# Altium schematic sheet Cyusb3014 - 4.SchDoc
size A3
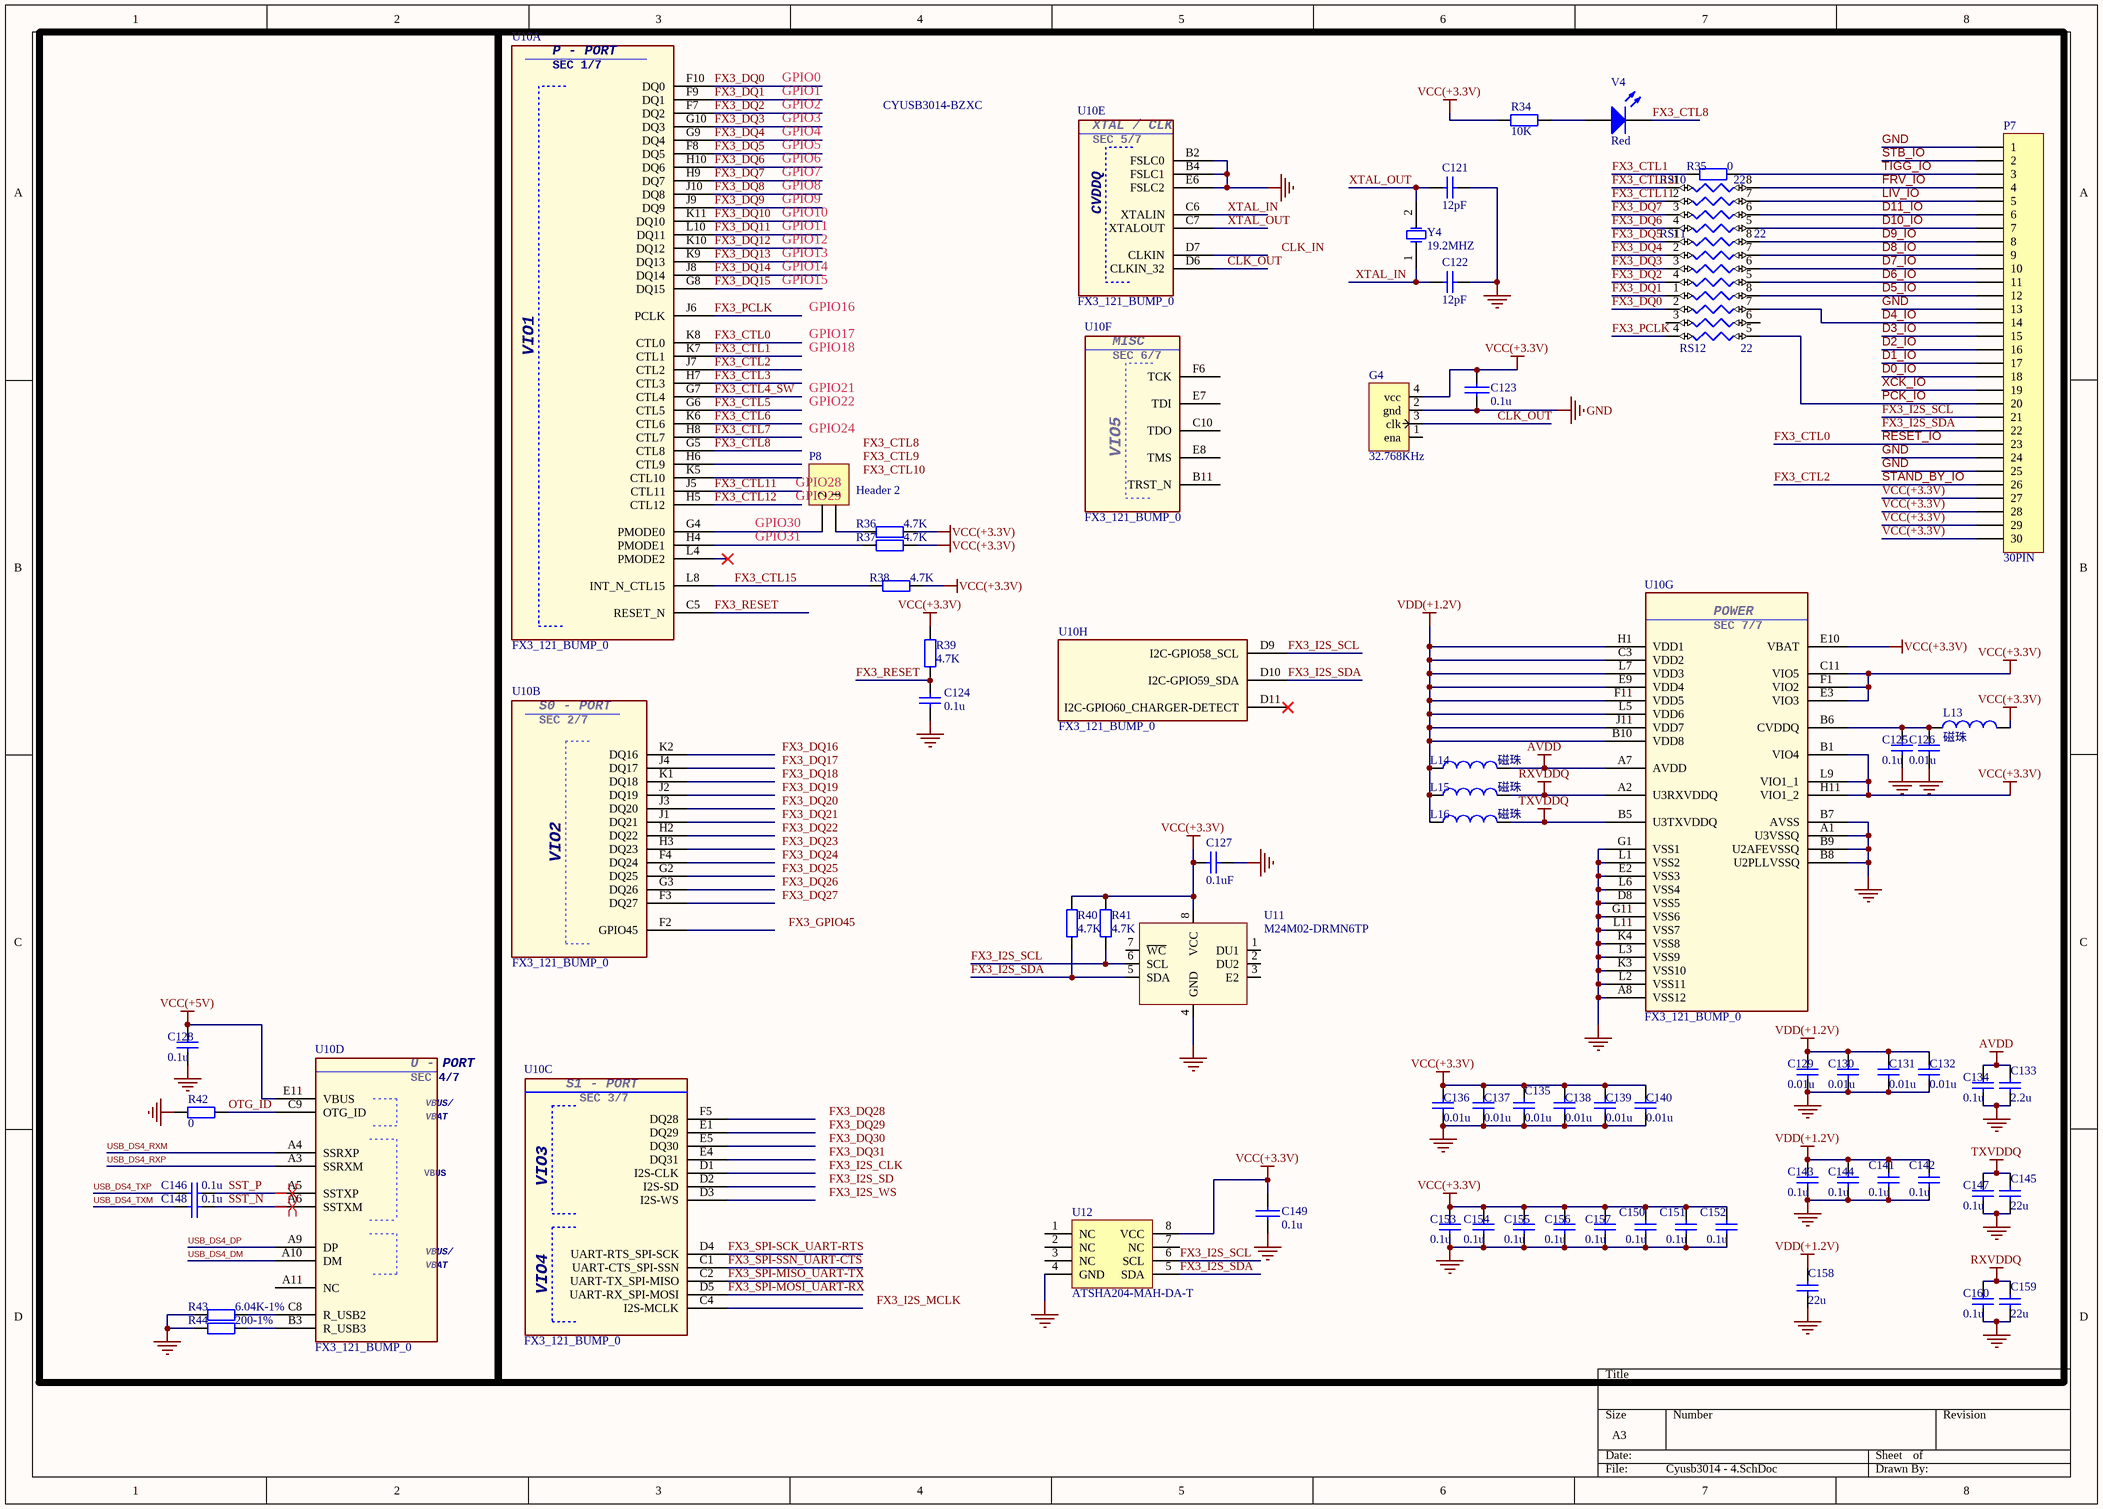
[diagram p0: Cyusb3014 - 4.SchDoc]

## Parts
C121  12pF  [0603S-CAP]
C122  12pF  [0603S-CAP]
C123  0.1u  [0603S-CAP]
C124  0.1u  [0603S-CAP]
C125  0.1u  [C0402]
C126  0.01u  [C0402]
C127  0.1uF  [0603S-CAP]
C128  0.1u  [C0402]
C129  0.01u  [C0402]
C130  0.01u  [C0402]
C131  0.01u  [C0402]
C132  0.01u  [C0402]
C133  2.2u  [C0805S-CAP]
C134  0.1u  [C0402]
C135  0.01u  [C0402]
C136  0.01u  [C0402]
C137  0.01u  [C0402]
C138  0.01u  [C0402]
C139  0.01u  [C0402]
C140  0.01u  [C0402]
C141  0.1u  [C0402]
C142  0.1u  [C0402]
C143  0.1u  [C0402]
C144  0.1u  [C0402]
C145  22u  [C0805S-CAP]
C146  0.1u  [C0402]
C147  0.1u  [C0402]
C148  0.1u  [C0402]
C149  0.1u  [0603S-CAP]
C150  0.1u  [C0402]
C151  0.1u  [C0402]
C152  0.1u  [C0402]
C153  0.1u  [C0402]
C154  0.1u  [C0402]
C155  0.1u  [C0402]
C156  0.1u  [C0402]
C157  0.1u  [C0402]
C158  22u  [C0805S-CAP]
C159  22u  [C0805S-CAP]
C160  0.1u  [C0402]
G4  32.768KHz  [爱普生晶振3.2×2.5mm]
L13  磁珠  [L0603]
L14  磁珠  [L0603]
L15  磁珠  [L0603]
L16  磁珠  [L0603]
P7  30PIN  [FH12-30S-0.5SH]
P8  Header 2  [HDR1X2]
R34  10K  [0603S-RES]
R35  0  [0603S-RES]
R36  4.7K  [0603S-RES]
R37  4.7K  [0603S-RES]
R38  4.7K  [0603S-RES]
R39  4.7K  [0603S-RES]
R40  4.7K  [0603S-RES]
R41  4.7K  [0603S-RES]
R42  0  [0603S-RES]
R43  6.04K-1%  [0603S-RES]
R44  200-1%  [0603S-RES]
RS10  22  [NC06-4]
RS11  22  [NC06-4]
RS12  22  [NC06-4]
U10  FX3_121_BUMP_0  [121_BGA_FX3]  (parts A,B,C,D,E,F,G,H of 8)
U11  M24M02-DRMN6TP  [SOIC127P600X175-8N]
U12  ATSHA204-MAH-DA-T  [UDFN]
V4  Red  [LED0805S]
Y4  19.2MHZ  [爱普生晶振3.2×2.5MM - 无源]

## Nets
AVDD: C133.2 C134.1 L14.2 U10.A7(AVDD)
GND: C121.1 C122.1 C123.2 C124.1 C125.2 C126.2 C127.1 C128.2 C129.2 C130.2 C131.2 C132.2 C133.1 C134.2 C135.2 C136.2 C137.2 C138.2 C139.2 C140.2 C141.2 C142.2 C143.2 C144.2 C145.1 C147.2 C149.2 C150.2 C151.2 C152.2 C153.2 C154.2 C155.2 C156.2 C157.2 C158.1 C159.1 C160.2 G4.2(gnd) P7.1 P7.13 P7.24 P7.25 R42.2 R43.2 R44.2 U10.A1(U3VSSQ) U10.A8(VSS12) U10.B2(FSLC0) U10.B4(FSLC1) U10.B7(AVSS) U10.B8(U2PLLVSSQ) U10.B9(U2AFEVSSQ) U10.D8(VSS5) U10.E2(VSS3) U10.E6(FSLC2) U10.G1(VSS1) U10.G11(VSS6) U10.K3(VSS10) U10.K4(VSS8) U10.L1(VSS2) U10.L2(VSS11) U10.L3(VSS9) U10.L6(VSS4) U10.L11(VSS7) U11.4(GND) U12.4(GND)
RXVDDQ: C159.2 C160.1 L15.2 U10.A2(U3RXVDDQ)
TXVDDQ: C145.2 C147.1 L16.2 U10.B5(U3TXVDDQ)
VCC(+3.3V): C123.1 C127.2 C135.1 C136.1 C137.1 C138.1 C139.1 C140.1 C149.1 C150.1 C151.1 C152.1 C153.1 C154.1 C155.1 C156.1 C157.1 G4.4(vcc) L13.2 P7.27 P7.28 P7.29 P7.30 R34.2 R36.2 R37.2 R38.1 R39.1 R40.2 R41.2 U10.B1(VIO4) U10.C11(VIO5) U10.E3(VIO3) U10.E10(VBAT) U10.F1(VIO2) U10.H11(VIO1_2) U10.L9(VIO1_1) U11.8(VCC) U12.8(VCC)
VCC(+5V): C128.1 U10.E11(VBUS)
VDD(+1.2V): C129.1 C130.1 C131.1 C132.1 C141.1 C142.1 C143.1 C144.1 C158.2 L14.1 L15.1 L16.1 U10.B10(VDD8) U10.C3(VDD2) U10.E9(VDD4) U10.F11(VDD5) U10.H1(VDD1) U10.J11(VDD7) U10.L5(VDD6) U10.L7(VDD3)
CLK_OUT: G4.3(clk) U10.D6(CLKIN_32)
D0_IO: P7.18
D1_IO: P7.17
D2_IO: P7.16
D3_IO: P7.15
D4_IO: P7.14 RS12.7
D5_IO: P7.12 RS12.8
D6_IO: P7.11 RS11.5
D7_IO: P7.10 RS11.6
D8_IO: P7.9 RS11.7
D9_IO: P7.8 RS11.8
D10_IO: P7.7 RS10.5
D11_IO: P7.6 RS10.6
FRV_IO: P7.4 RS10.8
FX3_CTL0: P7.23 U10.K8(CTL0)  [also labelled RESET_IO]
FX3_CTL1: R35.2 U10.K7(CTL1)
FX3_CTL2: P7.26 U10.J7(CTL2)  [also labelled STAND_BY_IO]
FX3_CTL3: U10.H7(CTL3)
FX3_CTL4_SW: U10.G7(CTL4)
FX3_CTL5: U10.G6(CTL5)
FX3_CTL6: U10.K6(CTL6)
FX3_CTL7: U10.H8(CTL7)
FX3_CTL8: U10.G5(CTL8) V4.2(K)
FX3_CTL11: RS10.2 U10.J5(CTL11)
FX3_CTL12: RS10.1 U10.H5(CTL12)
FX3_CTL15: R38.2 U10.L8(INT_N_CTL15)
FX3_DQ0: RS12.2 U10.F10(DQ0)
FX3_DQ1: RS12.1 U10.F9(DQ1)
FX3_DQ2: RS11.4 U10.F7(DQ2)
FX3_DQ3: RS11.3 U10.G10(DQ3)
FX3_DQ4: RS11.2 U10.G9(DQ4)
FX3_DQ5: RS11.1 U10.F8(DQ5)
FX3_DQ6: RS10.4 U10.H10(DQ6)
FX3_DQ7: RS10.3 U10.H9(DQ7)
FX3_DQ8: U10.J10(DQ8)
FX3_DQ9: U10.J9(DQ9)
FX3_DQ10: U10.K11(DQ10)
FX3_DQ11: U10.L10(DQ11)
FX3_DQ12: U10.K10(DQ12)
FX3_DQ13: U10.K9(DQ13)
FX3_DQ14: U10.J8(DQ14)
FX3_DQ15: U10.G8(DQ15)
FX3_I2S_SCL: P7.21 R41.1 U10.D9(I2C-GPIO58_SCL) U11.6(SCL) U12.6(SCL)
FX3_I2S_SDA: P7.22 R40.1 U10.D10(I2C-GPIO59_SDA) U11.5(SDA) U12.5(SDA)
FX3_PCLK: RS12.4 U10.J6(PCLK)
FX3_RESET: C124.2 R39.2 U10.C5(RESET_N)
FX3_SPI-MISO_UART-TX: U10.C2(UART-TX_SPI-MISO)
FX3_SPI-MOSI_UART-RX: U10.D5(UART-RX_SPI-MOSI)
FX3_SPI-SCK_UART-RTS: U10.D4(UART-RTS_SPI-SCK)
FX3_SPI-SSN_UART-CTS: U10.C1(UART-CTS_SPI-SSN)
LIV_IO: P7.5 RS10.7
OTG_ID: R42.1 U10.C9(OTG_ID)
PCK_IO: P7.20 RS12.5
SST_N: C148.2 U10.A6(SSTXM)
SST_P: C146.2 U10.A5(SSTXP)
STB_IO: P7.2
TIGG_IO: P7.3 R35.1
USB_DS4_DM: U10.A10(DM)
USB_DS4_DP: U10.A9(DP)
USB_DS4_RXM: U10.A4(SSRXP)
USB_DS4_RXP: U10.A3(SSRXM)
USB_DS4_TXM: C148.1
USB_DS4_TXP: C146.1
XCK_IO: P7.19
XTAL_IN: C122.2 U10.C6(XTALIN) Y4.1(OSC1)
XTAL_OUT: C121.2 U10.C7(XTALOUT) Y4.2(OSC2)
NetC125_1: C125.1 C126.1 L13.1 U10.B6(CVDDQ)
NetP8_1: P8.1 R36.1
NetP8_2: P8.2 U10.G4(PMODE0)
NetR34_1: R34.1 V4.1(A)
NetR37_1: R37.1 U10.H4(PMODE1)
NetR43_1: R43.1 U10.C8(R_USB2)
NetR44_1: R44.1 U10.B3(R_USB3)

Not connected (* = marked no-connect by the designer): G4 1(ena); RS12 3 6; U10 A11(NC) B11(TRST_N) C4(I2S-MCLK) C10(TDO) D1(I2S-CLK) D2(I2S-SD) D3(I2S-WS) D7(CLKIN) D11(I2C-GPIO60_CHARGER-DETECT)* E1(DQ29) E4(DQ31) E5(DQ30) E7(TDI) E8(TMS) F2(GPIO45) F3(DQ27) F4(DQ24) F5(DQ28) F6(TCK) G2(DQ25) G3(DQ26) H2(DQ22) H3(DQ23) H6(CTL9) J1(DQ21) J2(DQ19) J3(DQ20) J4(DQ17) K1(DQ18) K2(DQ16) K5(CTL10) L4(PMODE2)*; U11 1(DU1) 2(DU2) 3(E2) 7(~{WC}); U12 1(NC) 2(NC) 3(NC) 7(NC)

## Layout directives
differential pair: SST_N, SST_P

## Notes on the sheet
- GPIO0
- GPIO1
- GPIO2
- CYUSB3014-BZXC
- GPIO3
- GPIO4
- GPIO5
- GPIO6
- GPIO7
- GPIO8
- GPIO9
- GPIO10
- GPIO11
- GPIO12
- GPIO13
- GPIO14
- GPIO15
- GPIO16
- GPIO17
- GPIO18
- GPIO21
- GPIO22
- GPIO24
- (near P8) GPIO28
- (near P8) GPIO29
- (near P8) GPIO30
- (near P8) GPIO31
- Labels drawn without touching a wire or pin: CLK_IN, FX3_CTL8, FX3_CTL9, FX3_CTL10, FX3_DQ16, FX3_DQ17, FX3_DQ18, FX3_DQ19, FX3_DQ20, FX3_DQ21, FX3_DQ22, FX3_DQ23, FX3_DQ24, FX3_DQ25, FX3_DQ26, FX3_DQ27, FX3_DQ28, FX3_DQ29, FX3_DQ30, FX3_DQ31, FX3_GPIO45, FX3_I2S_CLK, FX3_I2S_MCLK, FX3_I2S_SD, FX3_I2S_WS
- (in symbol FX3_121_BUMP_0, part A) P - PORT; SEC 1/7; VIO1
- (in symbol FX3_121_BUMP_0, part B) S0 - PORT; SEC 2/7
- (in symbol FX3_121_BUMP_0, part C) S1 - PORT; SEC 3/7
- (in symbol FX3_121_BUMP_0, part D) U - PORT; SEC 4/7; VBUS/
- (in symbol FX3_121_BUMP_0, part E) XTAL / CLK; SEC 5/7
- (in symbol FX3_121_BUMP_0, part F) MISC; SEC 6/7
- (in symbol FX3_121_BUMP_0, part G) POWER; SEC 7/7

## Library data of the parts
C121 C122 = CAP CER SMT 4.3pF 0805: 2. Manufacturere Part Number: C0805C439D5GACTU; 1. Manufacturer: Kemet; 8. Alternate Part: any; 7. Package / Case: 0805; 0. Do Not Install: DNI; 6. Mounting Type: SMT; 5. Supplier Link: http://www.digikey.com/product-detail/en/C0805C439D5GACTU/C0805C439D5GACTU-ND/2212763; 3. Supplier: Digi-Key; 4. Supplier Part Number: C0805C439D5GACTU-ND
C123 C149 = CAP: RC=1206
C124 = Cap: 50V/8.2u/0805; Value: 100n; Published: 8-Jun-2000; LatestRevisionDate: 17-Jul-2002; LatestRevisionNote: Re-released for DXP Platform.; PackageReference: RAD-0.3; Publisher: Altium Limited
C125 C126 C128-C148 C150-C160 = CAP0805: Capacitor; Value: 104; Published: 8-Jun-2000; Revision: July-2002: Re-released for DXP Platform.; Publisher: Altium Limited
C127 = CAP SMT 0.1uF 16V X7R: 2. Manufacturere Part Number: C0805C104K4RACTU; 1. Manufacturer: Kemet; 8. Alternate Part: any; 7. Package / Case: 0805; 6. Mounting Type: SMT; 5. Supplier Link: http://www.digikey.com/product-detail/en/C0805C104K4RACTU/399-1167-1-ND/411442; 3. Supplier: Digi-Key; 4. Supplier Part Number: 399-1167-1-ND
G4 = CTY4-B
L13-L16 = Inductor: Code_IEC: 1005; Value: 10mH; Published: 8-Jun-2000; LatestRevisionDate: 29-May-2009; LatestRevisionNote: IPC-7351 Footprint Added.; PackageReference: 0402-A; Publisher: Altium Limited; PackageDescription: Chip Inductor; Code_JEITA: 0402
P7 = Header 30: Header, 30-Pin; LatestRevisionDate: 17-Jul-2002; LatestRevisionNote: Re-released for DXP Platform.; Publisher: Altium Limited
P8 = Header 2: Header, 2-Pin; LatestRevisionDate: 17-Jul-2002; LatestRevisionNote: Re-released for DXP Platform.; Publisher: Altium Limited
R34 = Res2: Resistor; Published: 8-Jun-2000; LatestRevisionDate: 17-Jul-2002; LatestRevisionNote: Re-released for DXP Platform.; PackageReference: AXIAL-0.4; Publisher: Altium Limited; Value: 10K
R35-R44 = Res2: Resistor; Value: 10K; Published: 8-Jun-2000; LatestRevisionDate: 17-Jul-2002; LatestRevisionNote: Re-released for DXP Platform.; PackageReference: AXIAL-0.4; Publisher: Altium Limited
RS10-RS12 = RN4: Option 2 - Device: *; Option 2 - Spec: *; Option 3 - Device: *; Option 3 - Spec: *; Option 4 - Device: *; Option 4 - Spec: *; Option 5 - Device: *; Option 5 - Spec: *; Option 6 - Device: *; Option 6 - Spec: *; Option 7 - Device: *; Option 7 - Spec: *; Option 8 - Device: *; Option 8 - Spec: *
U11 = 24LC64-I/SN: IC EEPROM 64KBIT 400KHZ 8SOIC; Manufacturer: Microchip Technology; Format - Memory: EEPROMs - Serial; Memory Size: 64K (8K x 8); Interface: I2C, 2-Wire Serial; Voltage - Supply: 2.5 V ~ 5.5 V; Supplier 1: Digi-Key; Manufacturer Part Number: 24LC64-I/SN; RoHS: RoHS Compliant; Category: Integrated Circuits (ICs); Stock 1: 16323; Pricing 1: 1=0.38, 25=0.37, 100=0.35 (USD); Packaging: Tube; Memory Type: EEPROM; Speed: 400kHz; Operating Temperature: -40°C ~ 85°C (TA); Package / Case: 8-SOIC (0.154", 3.90mm Width); Supplier Device Package: 8-SOIC; ComponentLink1URL: http://www.microchip.com/mymicrochip/filehandler.aspx?ddocname=en011843; ComponentLink1Description: http://www.microchip.com/mymicrochip/filehandler.aspx?ddocname=en011843; Supplier Part Number 1: 24LC64-I/SN-ND
U12 = AT24C128
V4 = LED0: Typical INFRARED GaAs LED; Published: 8-Jun-2000; LatestRevisionDate: 08-Jul-2005; LatestRevisionNote: Mech Layer 1 removed.; PackageReference: LED-0; Publisher: Altium Limited
Y4 = XTAL 32.768KHZ: Crystal, CRYSTAL 32.768KHZ 6PF SMD; 2. Manufacturere Part Number: ABS07-120-32.768KHZ-T; 1. Manufacturer: Abracon; 6. Mounting Type: SMT; 9. Notes: 2 pad - Abracon ABS07-120-32.768KHZ-T, 4 pad - Abracon ABS25-32.768KHZ-6-T; 0. Do Not Install: DNI; 5. Supplier Link: http://www.digikey.com/product-detail/en/ABS07-120-32.768KHZ-T/535-11937-1-ND/3724046; 3. Supplier: Digi-Key; 4. Supplier Part Number: 535-11937-1-ND